# Altium project KinetisCANBoard.PrjPCB
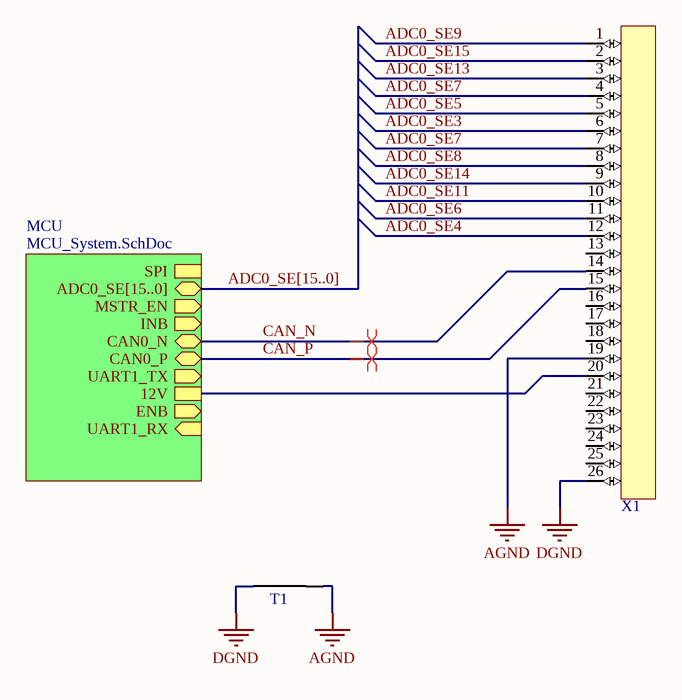
[diagram p0: KinetisCANBoard.SchDoc]
6 sheets, 33 parts. Net scope: hierarchical (ports join the sheet entries above them; power ports are global).
Board file: Board.PcbDoc
Sheets:
  KinetisCANBoard.SchDoc
    MCU = MCU_System.SchDoc
      MCU = Microcontroller.SchDoc
      COM = Communication.SchDoc
      PWR = Power.SchDoc
      USB = USB.SchDoc

## Sheet KinetisCANBoard.SchDoc
size A

### Parts
T1  Net Tie  [Net Tie 10mil]  (value not drawn)
X1  TE Superseal 26 POS  [TE_SUPERSEAL_26]  (value not drawn)

### Sub-sheets
MCU = MCU_System.SchDoc: SPI (harness SPI), ADC0_SE[15..0] (bidir), MSTR_EN (out), INB (out), CAN0_N (bidir), CAN0_P (bidir), UART1_TX (out), 12V, ENB (out), UART1_RX (in)

### Nets
AGND: T1.2 X1.19
DGND: T1.2 X1.26
12V: X1.20 ; sheet MCU/12V
ADC0_SE3: X1.6
ADC0_SE4: X1.12
ADC0_SE5: X1.5
ADC0_SE6: X1.11
ADC0_SE7: X1.4 X1.7
ADC0_SE8: X1.8
ADC0_SE9: X1.1
ADC0_SE11: X1.10
ADC0_SE13: X1.3
ADC0_SE14: X1.9
ADC0_SE15: X1.2
CAN_N: X1.14 ; sheet MCU/CAN0_N  [project net CAN0_N]
CAN_P: X1.15 ; sheet MCU/CAN0_P  [project net CAN0_P]

Not connected (* = marked no-connect by the designer): X1 13 16 17 18 21 22 23 24 25

### Buses and harness runs
bus ADC0_SE[15..0] = sheet MCU/ADC0_SE[15..0]

### Layout directives
differential pair: CAN0_N, CAN0_P

## Sheet MCU_System.SchDoc: MCU System
size A4; DrawnBy: Alvin Ha; DocumentNumber: MCU2018-1; Revision: 2.0; SheetNumber: 1; SheetTotal: 4
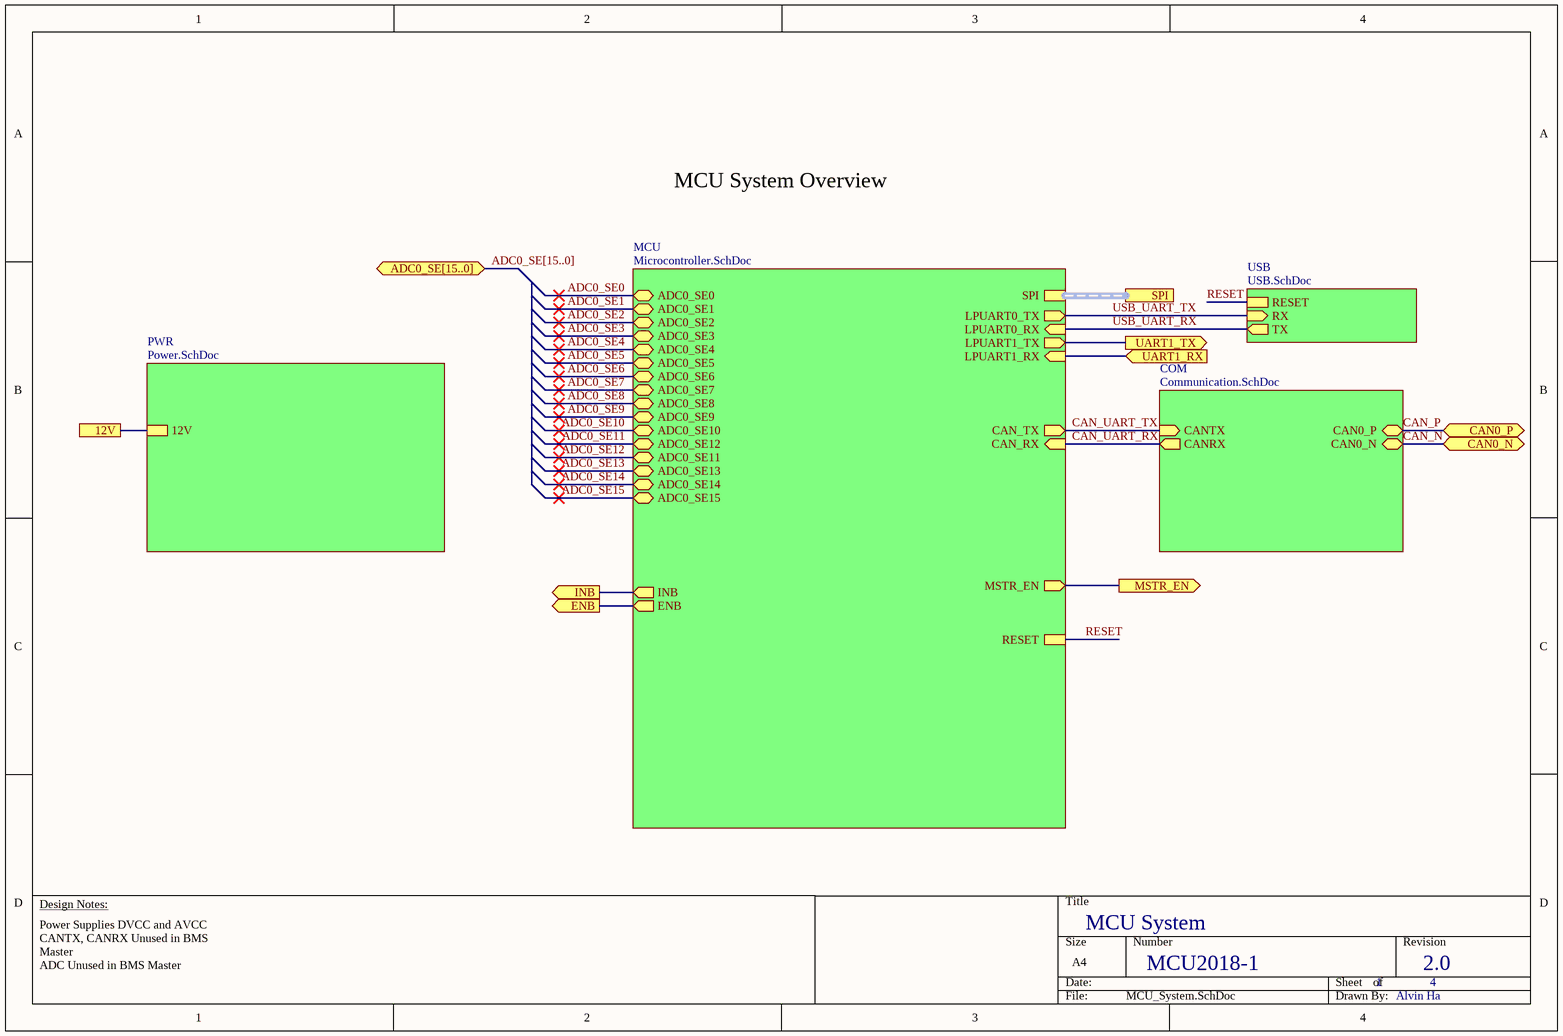
[diagram p1: MCU_System.SchDoc]

### Sub-sheets
COM = Communication.SchDoc: CAN0_P (bidir), CAN0_N (bidir), CANRX (out), CANTX (in)
MCU = Microcontroller.SchDoc: ADC0_SE3 (bidir), ADC0_SE6 (bidir), ADC0_SE4 (bidir), ADC0_SE1 (bidir), ADC0_SE13 (bidir), ADC0_SE7 (bidir), ADC0_SE5 (bidir), ADC0_SE14 (bidir), ADC0_SE12 (bidir), SPI (harness SPI), ADC0_SE2 (bidir), ADC0_SE0 (bidir), ADC0_SE11 (bidir), ADC0_SE15 (bidir), ADC0_SE8 (bidir), ADC0_SE10 (bidir), ADC0_SE9 (bidir), CAN_RX (in), CAN_TX (out), LPUART0_TX (out), LPUART0_RX (in), MSTR_EN (out), ENB (out), INB (out), LPUART1_TX (out), LPUART1_RX (in), RESET
PWR = Power.SchDoc: 12V
USB = USB.SchDoc: RESET, RX (in), TX (out)

### Ports
12V, ADC0_SE[15..0] (bidir), CAN0_N (bidir), CAN0_P (bidir), ENB (out), INB (out), MSTR_EN (out), SPI (harness SPI), UART1_RX (in), UART1_TX (out)

### Nets
12V: port 12V, sheet PWR/12V
CAN_N: port CAN0_N, sheet COM/CAN0_N  [project net CAN0_N]
CAN_P: port CAN0_P, sheet COM/CAN0_P  [project net CAN0_P]
CAN_UART_RX: sheet MCU/CAN_RX, sheet COM/CANRX
CAN_UART_TX: sheet MCU/CAN_TX, sheet COM/CANTX
RESET: sheet MCU/RESET, sheet USB/RESET  [project net JTAG_RST]
USB_UART_RX: sheet MCU/LPUART0_RX, sheet USB/TX  [project net FTDI_UART_TX]
USB_UART_TX: sheet MCU/LPUART0_TX, sheet USB/RX  [project net FTDI_UART_RX]
NetU7_17: port INB, sheet MCU/INB
NetU7_18: port ENB, sheet MCU/ENB
NetU7_35: port UART1_TX, sheet MCU/LPUART1_TX
NetU7_36: port UART1_RX, sheet MCU/LPUART1_RX
NetU7_44: port MSTR_EN, sheet MCU/MSTR_EN

### Buses and harness runs
bus ADC0_SE[15..0] = port ADC0_SE[15..0]
harness port SPI = sheet MCU/SPI

### Notes on the sheet
- MCU System Overview
- Design Notes:
- Power Supplies DVCC and AVCC
  CANTX, CANRX Unused in BMS Master
  ADC Unused in BMS Master

## Sheet Microcontroller.SchDoc: Microcontroller
size A4; DrawnBy: Alvin Ha; DocumentNumber: MCU2018-2; Revision: 2.0; SheetNumber: 2; SheetTotal: 4
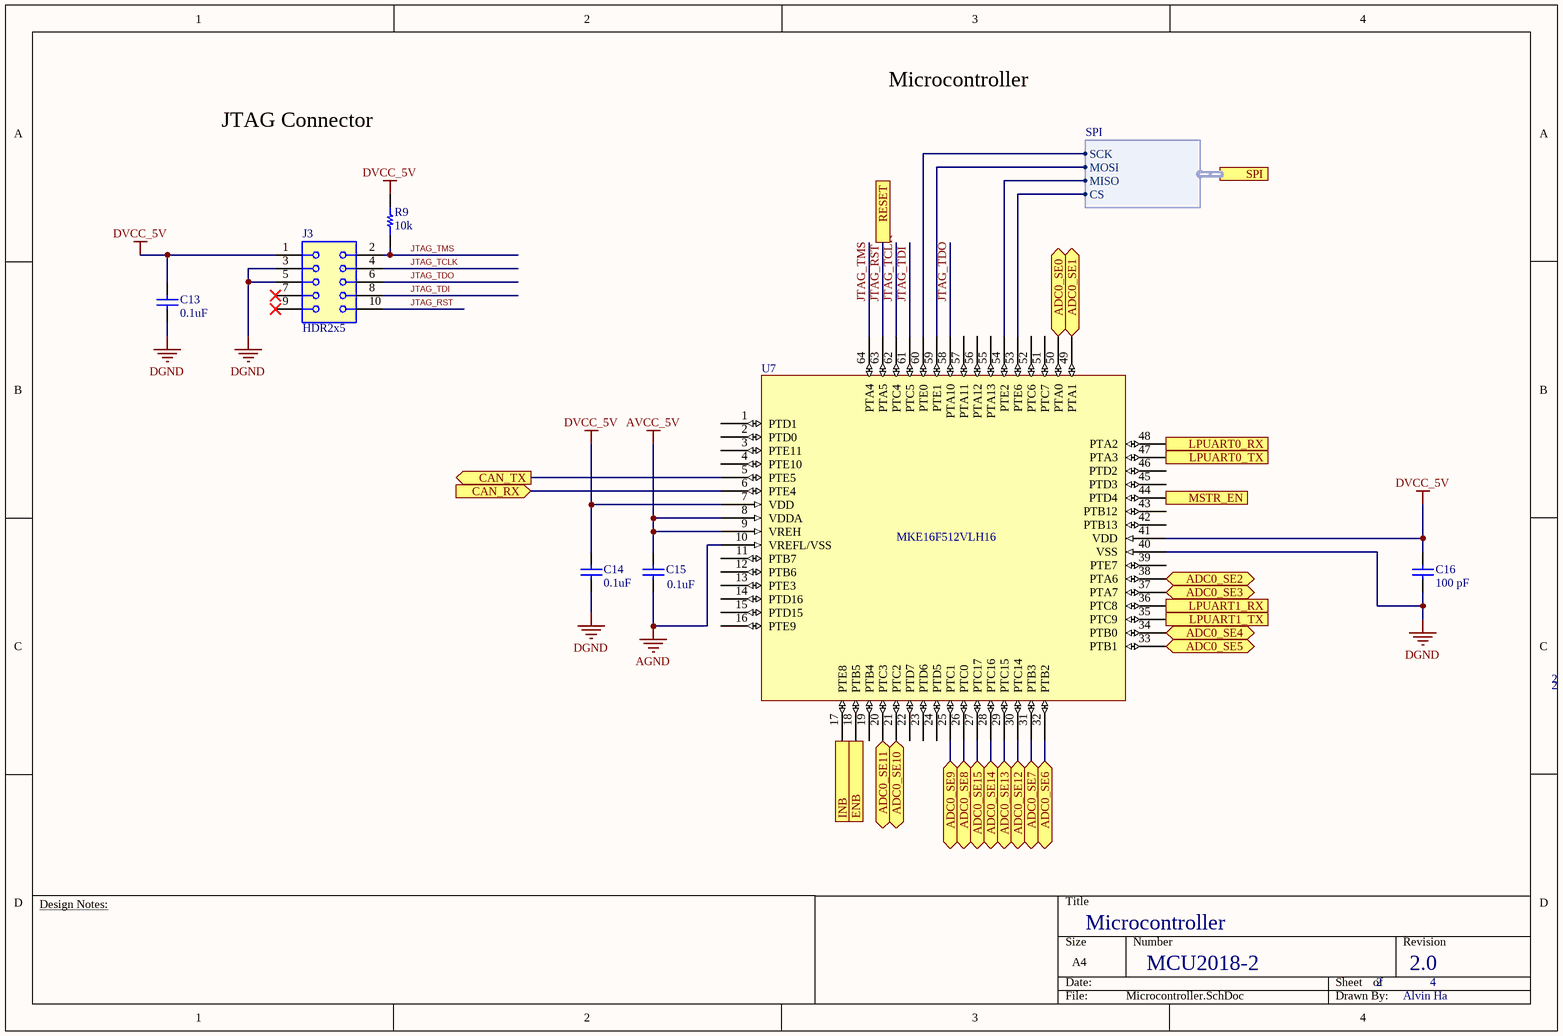
[diagram p2: Microcontroller.SchDoc]

### Parts
C13  0.1uF  [CAP SMT 0603]
C14  0.1uF  [CAP SMT 0603]
C15  0.1uF  [CAP SMT 0603]
C16  100 pF  [CAP SMT 0603]
J3  HDR2x5  [HDR 2x5]
R9  10k  [RES SMT 0805]
U7  MKE16F512VLH16  [MKE16F512VLH16]

### Ports
ADC0_SE0 (bidir), ADC0_SE1 (bidir), ADC0_SE2 (bidir), ADC0_SE3 (bidir), ADC0_SE4 (bidir), ADC0_SE5 (bidir), ADC0_SE6 (bidir), ADC0_SE7 (bidir), ADC0_SE8 (bidir), ADC0_SE9 (bidir), ADC0_SE10 (bidir), ADC0_SE11 (bidir), ADC0_SE12 (bidir), ADC0_SE13 (bidir), ADC0_SE14 (bidir), ADC0_SE15 (bidir), CAN_RX (in), CAN_TX (out), ENB (out), INB (out), LPUART0_RX (in), LPUART0_TX (out), LPUART1_RX (in), LPUART1_TX (out), MSTR_EN (out), RESET, SPI (harness SPI)

### Harnesses
SPI: MISO, CS, SCK, MOSI

### Nets
AGND: C15.1 U7.10(VREFL/VSS)
AVCC_5V: C15.2 U7.8(VDDA) U7.9(VREH)
DGND: C13.1 C14.1 C16.1 J3.3 J3.5 U7.40(VSS)
DVCC_5V: C13.2 C14.2 C16.2 J3.1 R9.2 U7.7(VDD) U7.41(VDD)
ADC0_SE0: U7.50(PTA0) ; port ADC0_SE0
ADC0_SE1: U7.49(PTA1) ; port ADC0_SE1
ADC0_SE2: U7.38(PTA6) ; port ADC0_SE2
ADC0_SE3: U7.37(PTA7) ; port ADC0_SE3
ADC0_SE4: U7.34(PTB0) ; port ADC0_SE4
ADC0_SE5: U7.33(PTB1) ; port ADC0_SE5
ADC0_SE6: U7.32(PTB2) ; port ADC0_SE6
ADC0_SE7: U7.31(PTB3) ; port ADC0_SE7
ADC0_SE8: U7.26(PTC0) ; port ADC0_SE8
ADC0_SE9: U7.25(PTC1) ; port ADC0_SE9
ADC0_SE10: U7.21(PTC2) ; port ADC0_SE10
ADC0_SE11: U7.30(PTC14) ; port ADC0_SE12
ADC0_SE12: U7.20(PTC3) ; port ADC0_SE11
ADC0_SE13: U7.29(PTC15) ; port ADC0_SE13
ADC0_SE14: U7.28(PTC16) ; port ADC0_SE14
ADC0_SE15: U7.27(PTC17) ; port ADC0_SE15
CAN_UART_RX: U7.6(PTE4) ; port CAN_RX
CAN_UART_TX: U7.5(PTE5) ; port CAN_TX
FTDI_UART_RX: U7.47(PTA3) ; port LPUART0_TX
FTDI_UART_TX: U7.48(PTA2) ; port LPUART0_RX
JTAG_RST: J3.10 U7.63(PTA5) ; port RESET
JTAG_TCLK: J3.4 U7.62(PTC4)
JTAG_TDI: J3.8 U7.61(PTC5)
JTAG_TDO: J3.6 U7.58(PTA10)
JTAG_TMS: J3.2 R9.1 U7.64(PTA4)
NetU7_17: U7.17(PTE8) ; port INB
NetU7_18: U7.18(PTB5) ; port ENB
NetU7_35: U7.35(PTC9) ; port LPUART1_TX
NetU7_36: U7.36(PTC8) ; port LPUART1_RX
NetU7_44: U7.44(PTD4) ; port MSTR_EN
NetU7_53: U7.53(PTE6) ; port SPI.CS
NetU7_54: U7.54(PTE2) ; port SPI.MISO
NetU7_59: U7.59(PTE1) ; port SPI.MOSI
NetU7_60: U7.60(PTE0) ; port SPI.SCK

Not connected (* = marked no-connect by the designer): J3 7* 9*; U7 1(PTD1) 2(PTD0) 3(PTE11) 4(PTE10) 11(PTB7) 12(PTB6) 13(PTE3) 14(PTD16) 15(PTD15) 16(PTE9) 19(PTB4) 22(PTD7) 23(PTD6) 24(PTD5) 39(PTE7) 42(PTB13) 43(PTB12) 45(PTD3) 46(PTD2) 51(PTC7) 52(PTC6) 55(PTA13) 56(PTA12) 57(PTA11)

### Notes on the sheet
- Microcontroller
- JTAG Connector
- Design Notes:

### Library data of the parts
C13-C15 = Capacitor 0.1uF 25V 0603: Supplier 1: Digi-Key; Supplier Part Number 1: 445-5667-6-ND
C16 = Capacitor 100 pF 25V 0603: Supplier 1: Digi-Key; Supplier Part Number 1: 445-4675-6-ND
R9 = Resistor 10k 1% 0805: Supplier 1: Digi-Key; Supplier Part Number 1: 541-10.0KCDKR-ND
J3 = HDR2x5: Supplier 1: Digi-Key; Supplier Part Number 1: 1175-1735-ND

## Sheet Communication.SchDoc: Communication
size A4; DrawnBy: Alvin Ha; DocumentNumber: MCU2018-4; Revision: 2.0; SheetNumber: 4; SheetTotal: 4
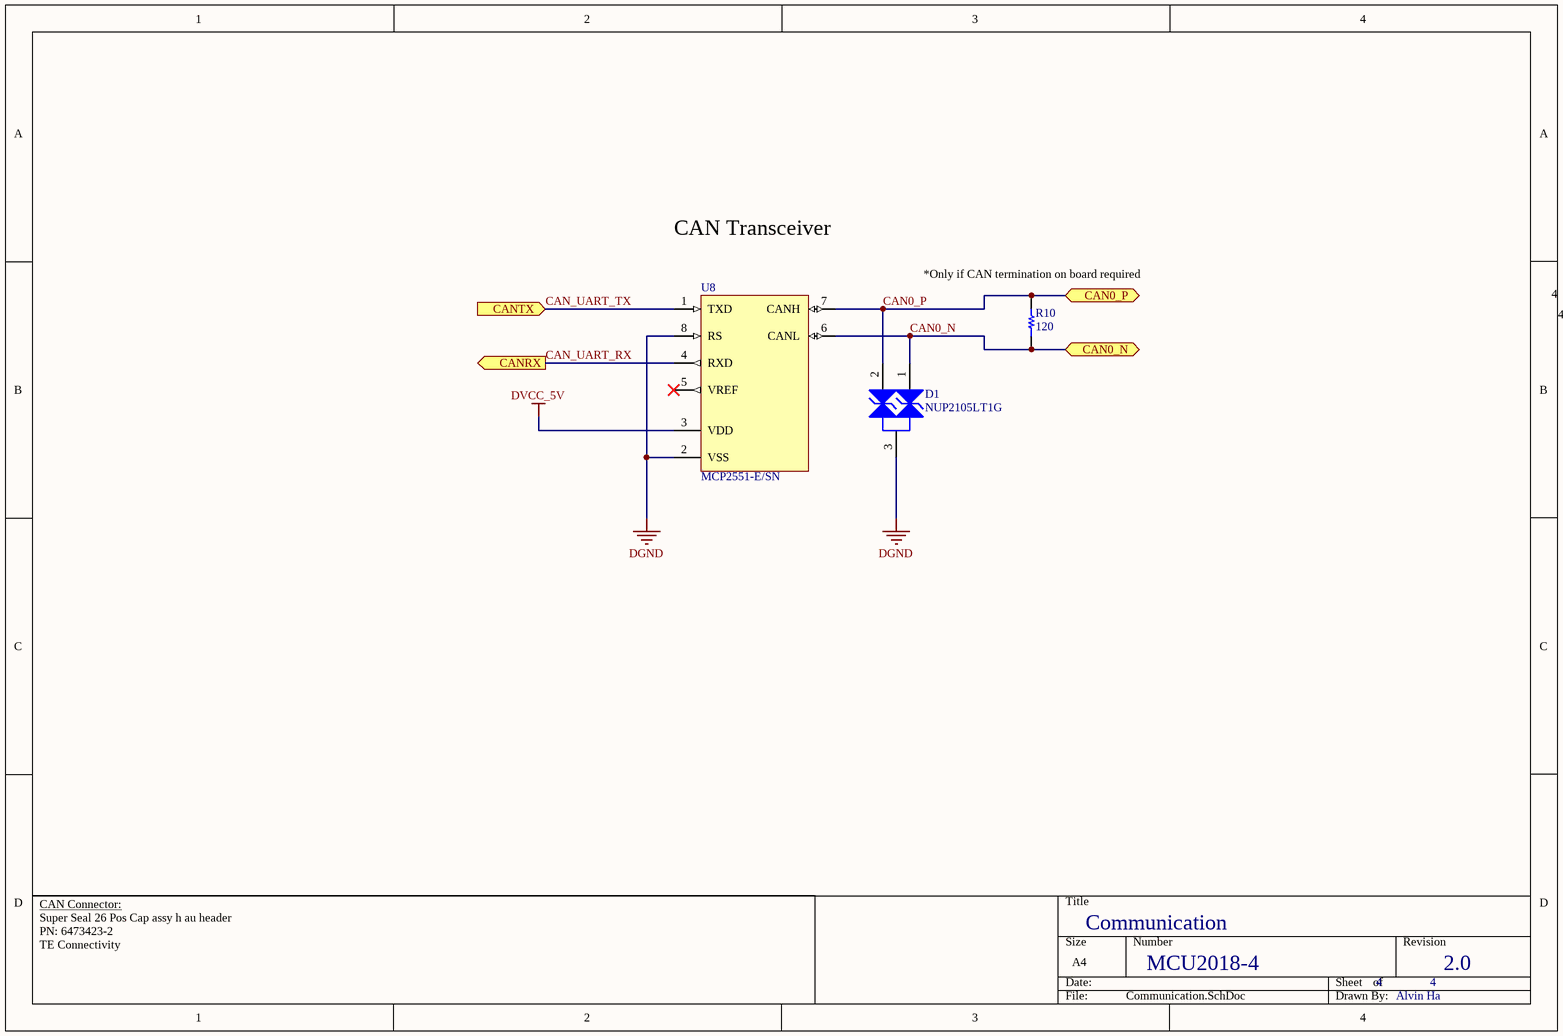
[diagram p3: Communication.SchDoc]

### Parts
D1  NUP2105LT1G  [ONSC-SOT-23-3-318-08_V]
R10  120  [RES SMT 0805]
U8  MCP2551-E/SN  [SOIC-SN8_N]

### Ports
CAN0_N (bidir), CAN0_P (bidir), CANRX (out), CANTX (in)

### Nets
DGND: D1.3(K) U8.2(VSS) U8.8(RS)
DVCC_5V: U8.3(VDD)
CAN0_N: D1.1(K) R10.1 U8.6(CANL) ; port CAN0_N
CAN0_P: D1.2(K) R10.2 U8.7(CANH) ; port CAN0_P
CAN_UART_RX: U8.4(RXD) ; port CANRX
CAN_UART_TX: U8.1(TXD) ; port CANTX

Not connected (* = marked no-connect by the designer): U8 5(VREF)*

### Notes on the sheet
- CAN Transceiver
- (near R10) *Only if CAN termination on board required
- CAN Connector:
- Super Seal 26 Pos Cap assy h au header
  PN: 6473423-2
  TE Connectivity

### Library data of the parts
D1 = CMP-1063-00164-1: Dual Line CAN Bus Protector, 3-Pin SOT-23, Pb-Free, Tape and Reel; Manufacturer: On Semiconductor; IR Max (uA): 0.1; Number of Lines: 2; Direction: Bidirectional; C Max (pF): 30; PPK Max (W): 350; V(BR) Min (V): 26.2; ComponentLink3URL: http://www.onsemi.cn/pub_link/Collateral/318-08.PDF; Mounting Technology: Surface Mount; ComponentLink2Description: Datasheet; PartNumber: NUP2105LT1G; ComponentLink1URL: http://www.onsemi.com/; PackageVersion: Rev. AP, 11/2009; DatasheetVersion: Rev. 5; RoHS: Pb-Free; PackageReference: SOT-23-3-318-08; ComponentLink2URL: http://www.onsemi.cn/pub_link/Collateral/NUP2105L-D.PDF; ComponentLink1Description: Manufacturer URL; PackageDescription: 3-Pin Small Outline Transistor, Body 2.92 x 1.3 mm, Pitch 0.95 mm; Packing: Tape and Reel; ComponentLink3Description: Package Specification
R10 = Resistor 120 1% 0805: Supplier 1: Digi-Key; Supplier Part Number 1: 541-120CDKR-ND
U8 = CMP-0186-00038-2: High-Speed CAN Transceiver, 8-Pin SOIC, Extended Temperature; PackageReference: SOIC-SN8; Code_JEDEC: MS-012; ComponentLink1Description: Manufacturer URL; ComponentLink1URL: http://www.microchip.com/; PackageVersion: revBB, Aug-2009; ComponentLink3Description: Package Specification; Code_IPC: SOIC127P600-8; ComponentLink2URL: http://ww1.microchip.com/downloads/en/DeviceDoc/21667F.pdf; RevisionNote: URLs added. DatasheetVersion updated.; ComponentLink3URL: http://www.microchip.com/stellent/groups/techpub_sg/documents/packagingspec/en012702.pdf; DatasheetVersion: revF, Jul-2010; ComponentLink2Description: Datasheet; PackageDescription: 8-Lead Plastic Small Outline (SN) - Narrow, 3.90mm Body [SOIC]

## Sheet Power.SchDoc: Power
size A4; DrawnBy: Alvin Ha; DocumentNumber: MCU2018-3; Revision: 2.0; SheetNumber: 3; SheetTotal: 4
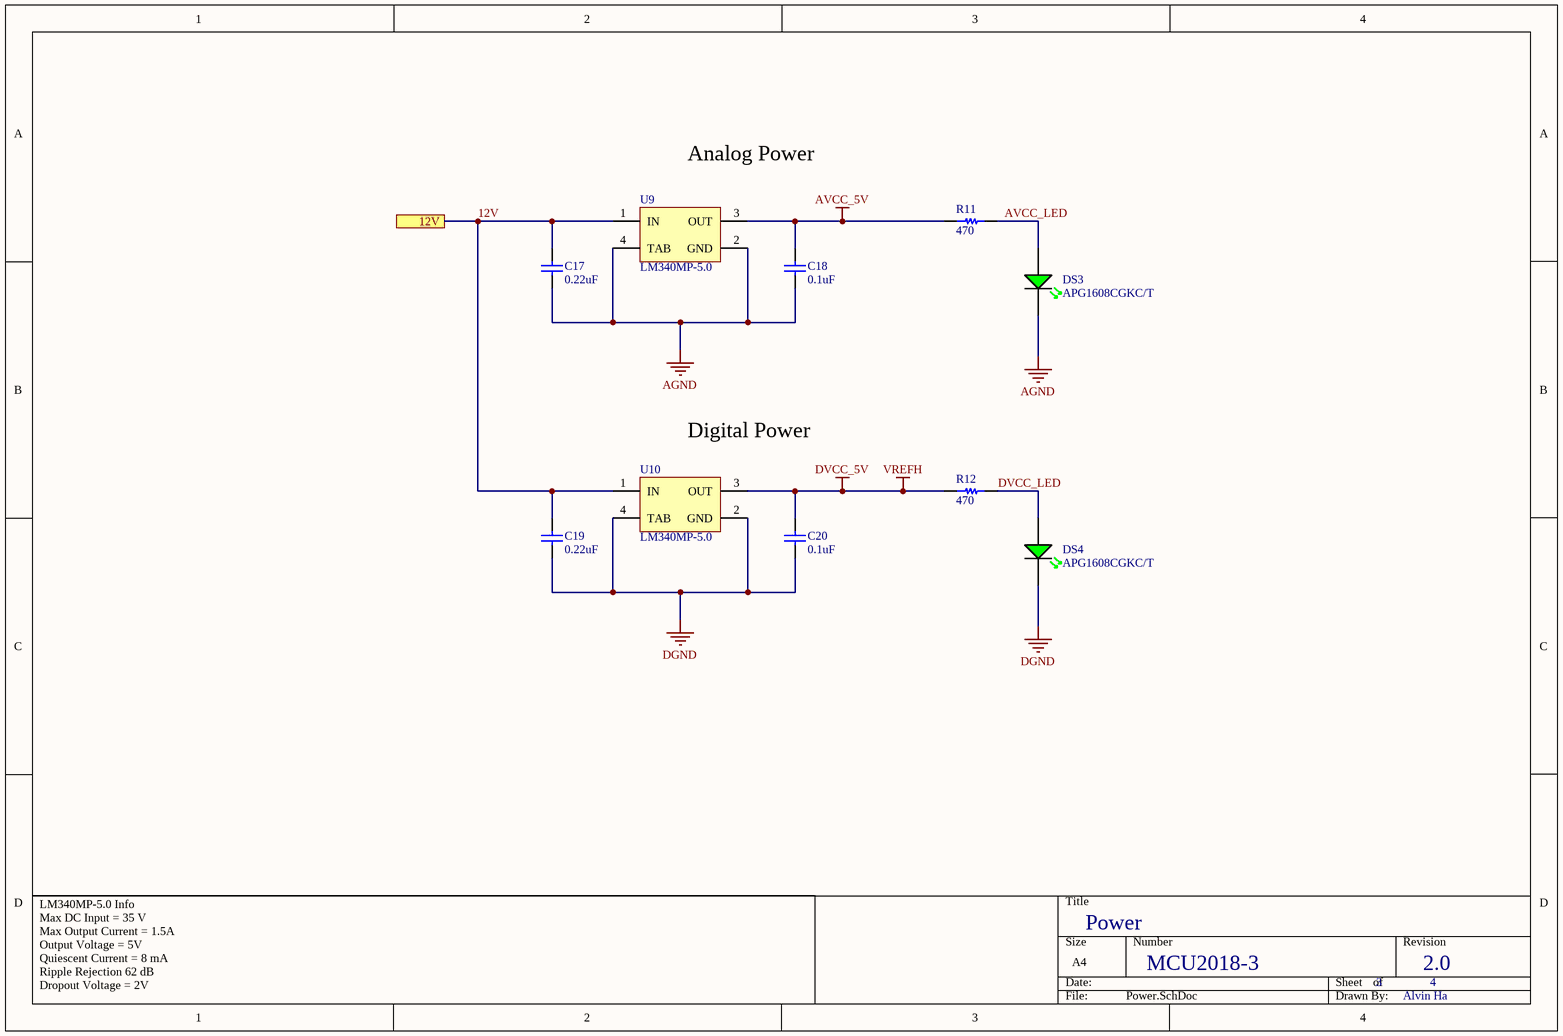
[diagram p4: Power.SchDoc]

### Parts
C17  0.22uF  [CAP SMT 0603]
C18  0.1uF  [CAP SMT 0603]
C19  0.22uF  [CAP SMT 0603]
C20  0.1uF  [CAP SMT 0603]
DS3  APG1608CGKC/T  [GREEN LED]
DS4  APG1608CGKC/T  [GREEN LED]
R11  470  [RES SMT 0805]
R12  470  [RES SMT 0805]
U9  LM340MP-5.0  [DCY0004A_M]
U10  LM340MP-5.0  [DCY0004A_M]

### Ports
12V

### Nets
AGND: C17.1 C18.1 DS3.1 U9.2(GND) U9.4(TAB)
AVCC_5V: C18.2 R11.1 U9.3(OUT)
DGND: C19.1 C20.1 DS4.1 U10.2(GND) U10.4(TAB)
DVCC_5V: C20.2 R12.1 U10.3(OUT)  [also labelled VREFH]
12V: C17.2 C19.2 U9.1(IN) U10.1(IN) ; port 12V
AVCC_LED: DS3.2 R11.2
DVCC_LED: DS4.2 R12.2

### Notes on the sheet
- Analog Power
- (near U10) Digital Power
- LM340MP-5.0 Info
  Max DC Input = 35 V
  Max Output Current = 1.5A
  Output Voltage = 5V
  Quiescent Current = 8 mA
  Ripple Rejection 62 dB
  Dropout Voltage = 2V

### Library data of the parts
C17 C19 = Capacitor 0.22uF 25V 0603: Supplier 1: Digi-Key; Supplier Part Number 1: 445-5191-6-ND
C18 C20 = Capacitor 0.1uF 25V 0603: Supplier 1: Digi-Key; Supplier Part Number 1: 445-5667-6-ND
DS3 DS4 = Green LED: Supplier 1: Digi-Key; Supplier Part Number 1: 754-1357-6-ND
R11 R12 = Resistor 470 1% 0805: Supplier 1: Digi-Key; Supplier Part Number 1: 541-470KCDKR-ND
U9 U10 = CMP-0062-01765-3: Series 3-Terminal Positive Regulators, 4-pin SOT-223; Manufacturer: Texas Instruments; CompType: LDO IC; PackageTopMarking: XYTT*N00A; PowerWise: N; PackageReference: DCY0004A; Code_IPC: SOT223-4; RoHS: N; PackageDescription: Molded SOT-223, 6.50 x 3.56 x 1.6mm Body, 4 Lead, 2.3mm Pitch; ComponentLink1URL: http://www.ti.com/general/docs/lit/getliterature.tsp?genericPartNumber=LM340-N&fileType=pdf; ComponentLink1Description: Datasheet URL; PinCount: 4; Code_JEDEC: TO-261-AA

## Sheet USB.SchDoc
size A
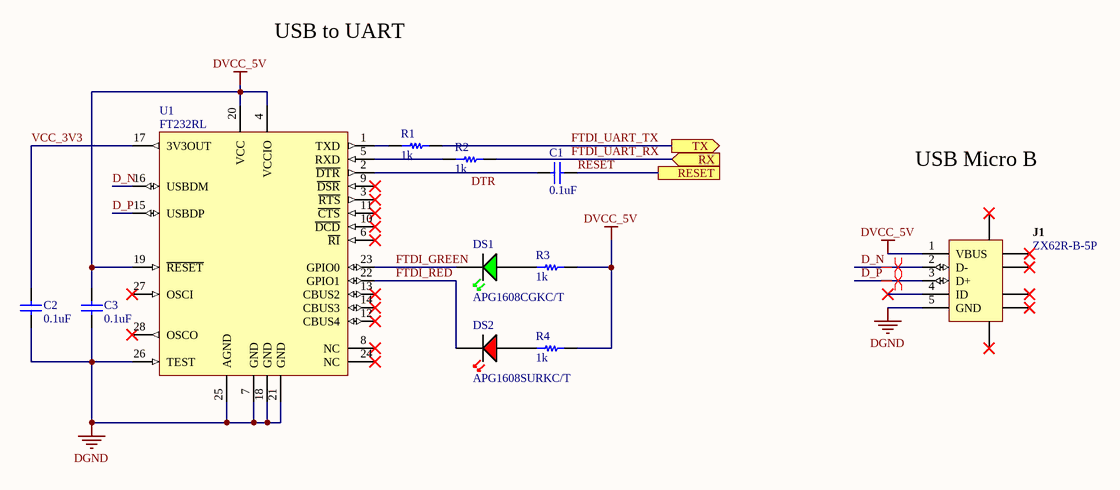
[diagram p5: USB.SchDoc]

### Parts
C1  0.1uF  [CAP SMT 0603]
C2  0.1uF  [CAP SMT 0603]
C3  0.1uF  [CAP SMT 0603]
DS1  APG1608CGKC/T  [GREEN LED]
DS2  APG1608SURKC/T  [RED LED]
J1  ZX62R-B-5P  [HIRO-ZX62R-B-5P_V]
R1  1k  [RES SMT 0805]
R2  1k  [RES SMT 0805]
R3  1k  [RES SMT 0805]
R4  1k  [RES SMT 0805]
U1  FT232RL  [SSOP-28_L]

### Ports
RESET, RX (in), TX (out)

### Nets
DGND: C2.1 C3.1 J1.5(GND) U1.7(GND) U1.18(GND) U1.21(GND) U1.25(AGND) U1.26(TEST)
DVCC_5V: C3.2 J1.1(VBUS) R3.2 R4.2 U1.4(VCCIO) U1.19(~{RESET}) U1.20(VCC)
D_N: J1.2(D-) U1.16(USBDM)
D_P: J1.3(D+) U1.15(USBDP)
DTR: C1.1 U1.2(~{DTR})
FTDI_GREEN: DS1.1 U1.23(GPIO0)
FTDI_RED: DS2.1 U1.22(GPIO1)
FTDI_UART_RX: R2.2 ; port RX
FTDI_UART_TX: R1.2 ; port TX
RESET: C1.2 ; port RESET  [project net JTAG_RST]
VCC_3V3: C2.2 U1.17(3V3OUT)
NetDS1_2: DS1.2 R3.1
NetDS2_2: DS2.2 R4.1
NetR1_1: R1.1 U1.1(TXD)
NetR2_1: R2.1 U1.5(RXD)

Not connected (* = marked no-connect by the designer): J1 4(ID)* 6(SHLD)* 7(SHLD)* 8(SHLD)* 9(SHLD)* 10(SHLD)* 11(SHLD)*; U1 3(~{RTS})* 6(~{RI})* 8(NC)* 9(~{DSR})* 10(~{DCD})* 11(~{CTS})* 12(CBUS4)* 13(CBUS2)* 14(CBUS3)* 24(NC)* 27(OSCI)* 28(OSCO)*

### Layout directives
differential pair: D_N, D_P

### Notes on the sheet
- USB to UART
- USB Micro B

### Library data of the parts
C1-C3 = Capacitor 0.1uF 25V 0603: Supplier 1: Digi-Key; Supplier Part Number 1: 445-5667-6-ND
DS1 = Green LED: Supplier 1: Digi-Key; Supplier Part Number 1: 754-1357-6-ND
DS2 = RED LED: Supplier 1: Digi-Key; Supplier Part Number 1: 754-1359-6-ND
J1 = CMP-0031-00001-1: Connector; USBMicro-B,Reverse type, SMT; 5 Position; Right Angle; DatasheetVersion: 08/2010; Operating Temperature: -30 to 85 degC; Mounting Technology: Surface Mount; PartNumber: ZX62R-B-5P; PackageReference: ZX62R-B-5P; ComponentLink2URL: http://www.hirose.co.jp/cataloge_hp/e24200011.pdf; ComponentLink1URL: http://www.hirose.com/â€Ž; ComponentLink2Description: Datasheet; PackageDescription: 5-Pin USB Micro-B R/A Connector; ComponentLink1Description: Manufacturer URL
R1-R4 = Resistor 1k 1% 0805: Supplier 1: Digi-Key; Supplier Part Number 1: 541-1.00KCDKR-ND
U1 = CMP-0078-00029-1: USB UART Asynchronous Serial Data Transfer Chip, SSOP-28, Tape and Reel; DatasheetVersion: ver 2.07, Jul-2010; PackageDescription: 28-Pin Small Outline Package 0.65 mm Pitch; PackageVersion: 2010; PackageReference: SSOP-28

## Nets that join several sheets
AGND: KinetisCANBoard (T1.2 X1.19), Microcontroller (C15.1 U7.10), Power (5 pins)
AVCC_5V: Microcontroller (C15.2 U7.8 U7.9), Power (C18.2 R11.1 U9.3)
DGND: KinetisCANBoard (T1.2 X1.26), Microcontroller (6 pins), Communication (D1.3 U8.2 U8.8), Power (5 pins), USB (8 pins)
DVCC_5V: Microcontroller (7 pins), Communication (U8.3), Power (C20.2 R12.1 U10.3), USB (7 pins)
12V: KinetisCANBoard (X1.20), Power (C17.2 C19.2 U9.1 U10.1)
ADC0_SE3: KinetisCANBoard (X1.6), Microcontroller (U7.37)
ADC0_SE4: KinetisCANBoard (X1.12), Microcontroller (U7.34)
ADC0_SE5: KinetisCANBoard (X1.5), Microcontroller (U7.33)
ADC0_SE6: KinetisCANBoard (X1.11), Microcontroller (U7.32)
ADC0_SE7: KinetisCANBoard (X1.4 X1.7), Microcontroller (U7.31)
ADC0_SE8: KinetisCANBoard (X1.8), Microcontroller (U7.26)
ADC0_SE9: KinetisCANBoard (X1.1), Microcontroller (U7.25)
ADC0_SE11: KinetisCANBoard (X1.10), Microcontroller (U7.30)
ADC0_SE13: KinetisCANBoard (X1.3), Microcontroller (U7.29)
ADC0_SE14: KinetisCANBoard (X1.9), Microcontroller (U7.28)
ADC0_SE15: KinetisCANBoard (X1.2), Microcontroller (U7.27)
CAN0_N: KinetisCANBoard (X1.14), Communication (D1.1 R10.1 U8.6)
CAN0_P: KinetisCANBoard (X1.15), Communication (D1.2 R10.2 U8.7)
CAN_UART_RX: Microcontroller (U7.6), Communication (U8.4)
CAN_UART_TX: Microcontroller (U7.5), Communication (U8.1)
FTDI_UART_RX: Microcontroller (U7.47), USB (R2.2)
FTDI_UART_TX: Microcontroller (U7.48), USB (R1.2)
JTAG_RST: Microcontroller (J3.10 U7.63), USB (C1.2)